# EAGLE design L6470Breakout (EAGLE 6.1)
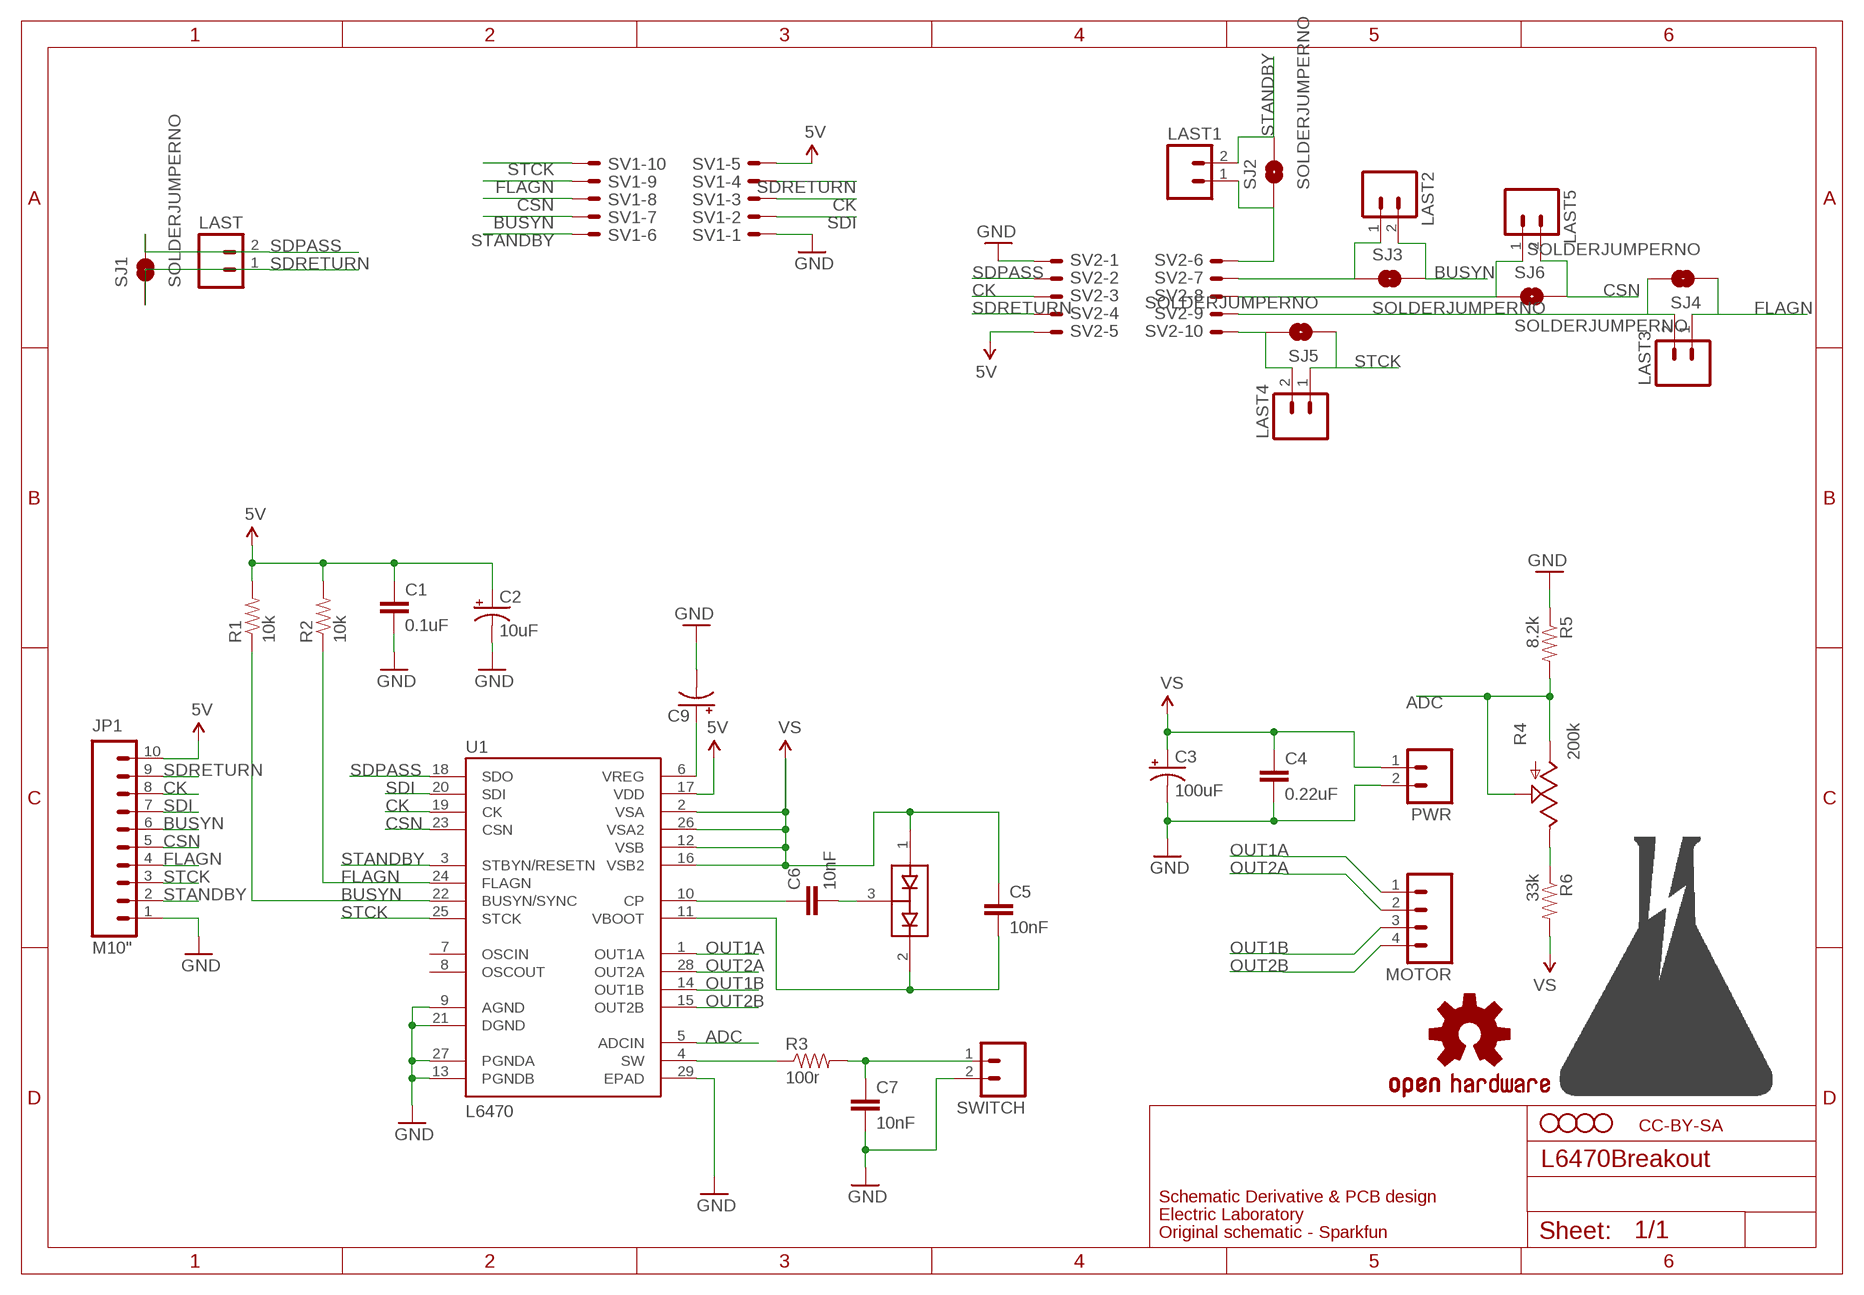
[diagram p0: schematic, sheet 1]

## Parts
C1  0.1uF  CAP0603-CAP  [0603-CAP]
C2  10uF  CAP_POL1206  [EIA3216]
C3  100uF  CAP_POLH13  [PANASONIC_H13]
C4  0.22uF  CAP0603-CAP  [0603-CAP]
C5  10nF  CAP0603-CAP  [0603-CAP]
C6  10nF  CAP0603-CAP  [0603-CAP]
C7  10nF  CAP0603-CAP  [0603-CAP]
C9  CAP_POL1206  [EIA3216]
D1  BAV99  [SOT23]
JP1  M10"  [1X10]
JP3  STAND-OFF  [STAND-OFF]
JP4  STAND-OFF  [STAND-OFF]
JP6  STAND-OFF  [STAND-OFF]
JP7  STAND-OFF  [STAND-OFF]
LAST  M02PTH  [1X02]
LAST1  M02PTH  [1X02]
LAST2  M02PTH  [1X02]
LAST3  M02PTH  [1X02]
LAST4  M02PTH  [1X02]
LAST5  M02PTH  [1X02]
MOTOR  M04SCREW  [SCREWTERMINAL-3.5MM-4]
PWR  M023.5MM  [SCREWTERMINAL-3.5MM-2]
R1  10k  RESISTOR0603-RES  [0603-RES]
R2  10k  RESISTOR0603-RES  [0603-RES]
R3  100r  RESISTOR0603-RES  [0603-RES]
R4  200k  POT100K_3362U  [3362U]
R5  8.2k  RESISTOR0603-RES  [0603-RES]
R6  33k  RESISTOR0603-RES  [0603-RES]
SJ1  SOLDERJUMPERNO  [SJ_2S-NO]
SJ2  SOLDERJUMPERNO  [SJ_2S-NO]
SJ3  SOLDERJUMPERNO  [SJ_2S-NO]
SJ4  SOLDERJUMPERNO  [SJ_2S-NO]
SJ5  SOLDERJUMPERNO  [SJ_2S-NO]
SJ6  SOLDERJUMPERNO  [SJ_2S-NO]
SV1  ML10E  [ML10]
SV2  ML10E  [ML10]
SWITCH  M023.5MM  [SCREWTERMINAL-3.5MM-2]
U1  L6470  L6470  [HTSSOP28]
U$4  OSHW-LOGOS  [OSHW-LOGO-S]
U$5  EL-LOGO  [EL-LOGO]

## Nets
5V: C1.1 C2.A(+) JP1.10 R1.2 R2.2 SV1.5 SV2.5 U1.17(VDD)
ADC: R4.P$2(S) R4.P$3(A) R5.2 U1.5(ADCIN)
BUSYN: JP1.6 LAST2.2 R1.1 SJ3.2 SV1.7 U1.22(BUSYN/SYNC)
CK: JP1.8 SV1.3 SV2.3 U1.19(CK)
CSN: JP1.5 LAST5.2 SJ6.2 SV1.8 U1.23(CSN)
FLAGN: JP1.4 LAST3.1 R2.1 SJ4.1 SV1.9 U1.24(FLAGN)
GND: C1.2 C2.C(-) C3.- C4.2 C7.2 C9.C(-) JP1.1 PWR.2 R5.1 SV1.1 SV2.1 SWITCH.2 U1.9(AGND) U1.13(PGNDB) U1.21(DGND) U1.27(PGNDA) U1.29(EPAD)
N$1: C9.A(+) U1.6(VREG)
N$2: LAST2.1 SJ3.1 SV2.7
N$3: LAST5.1 SJ6.1 SV2.8
N$5: R3.1 U1.4(SW)
N$6: C7.1 R3.2 SWITCH.1
N$7: C6.1 U1.10(CP)
N$8: C6.2 D1.3(COM)
N$9: C5.2 D1.2(C2) U1.11(VBOOT)
N$11: R4.P$1(E) R6.1
N$12: LAST3.2 SJ4.2 SV2.9
N$13: LAST1.1 SJ2.1 SV2.6
N$14: LAST4.2 SJ5.2 SV2.10
OUT1A: MOTOR.1 U1.1(OUT1A)
OUT1B: MOTOR.3 U1.14(OUT1B)
OUT2A: MOTOR.2 U1.28(OUT2A)
OUT2B: MOTOR.4 U1.15(OUT2B)
SDI: JP1.7 SV1.2 U1.20(SDI)
SDPASS: LAST.2 SJ1.2 SV2.2 U1.18(SDO)
SDRETURN: JP1.9 LAST.1 SJ1.1 SV1.4 SV2.4
STANDBY: JP1.2 LAST1.2 SJ2.2 SV1.6 U1.3(STBYN/RESETN)
STCK: JP1.3 LAST4.1 SJ5.1 SV1.10 U1.25(STCK)
VCC: C3.+ C4.1 C5.1 D1.1(A1) PWR.1 R6.2 U1.2(VSA) U1.12(VSB) U1.16(VSB2) U1.26(VSA2) ; supply symbol labelled VS
Unconnected: U1.7(OSCIN) U1.8(OSCOUT)

## Notes on the sheet
- CC-BY-SA
- Schematic Derivative & PCB design
- Electric Laboratory
- Original schematic - Sparkfun

## Library data of the parts
C1 C5-C7 = SparkFun-Passives:CAP: Capacitor Standard 0603 ceramic capacitor, and 0.1" leaded capacitor.
C2 = SparkFun:CAP_POL: Capacitor Polarized These are standard SMD and PTH capacitors. Normally 10uF, 47uF, and 100uF in electrolytic and tantalum varieties. Always verify the external diameter of the through hole cap, it varies with capacity, voltage, and manufacturer. The EIA devices should be standard.
C3 = miscellany:CAP_POL: Capacitor Polarized These are standard SMD and PTH capacitors. Normally 10uF, 47uF, and 100uF in electrolytic and tantalum varieties. Always verify the external diameter of the through hole cap, it varies with capacity, voltage, and manufacturer. The EIA devices should be standard.
C4 = SparkFun:CAP: Capacitor Standard 0603 ceramic capacitor, and 0.1" leaded capacitor.
C9 = SparkFun-Passives:CAP_POL: Capacitor Polarized These are standard SMD and PTH capacitors. Normally 10uF, 47uF, and 100uF in electrolytic and tantalum varieties. Always verify the external diameter of the through hole cap, it varies with capacity, voltage, and manufacturer. The EIA devices should be standard.
D1 = miscellany:BAV99: BAV99 Two small signal silicon diodes connected anode to cathode. Connections to all three nodes available.
JP1 = SparkFun:M10: Header 10 Standard 10-pin 0.1" header. Use with straight break away headers (SKU : PRT-00116), right angle break away headers (PRT-00553), swiss pins (PRT-00743), machine pins (PRT-00117), and female headers (PRT-00115).
JP3 JP4 JP6 JP7 = SparkFun-Electromechanical:STAND-OFF: #4 Stand Off This is the mechanical footprint for a #4 phillips button head screw. Use the keepout ring to avoid running the screw head into surrounding components. SKU : PRT-00447
LAST LAST1-LAST5 = SparkFun-Connectors:M02: Header 2 Standard 2-pin 0.1" header. Use with straight break away headers (SKU : PRT-00116), right angle break away headers (PRT-00553), swiss pins (PRT-00743), machine pins (PRT-00117), and female headers (PRT-00115). Molex polarized connector foot print use with SKU : PRT-08233 with associated crimp pins and housings.
MOTOR = SparkFun-Connectors:M04: Header 4 Standard 4-pin 0.1" header. Use with straight break away headers (SKU : PRT-00116), right angle break away headers (PRT-00553), swiss pins (PRT-00743), machine pins (PRT-00117), and female headers (PRT-00115). Molex polarized connector foot print use with SKU : PRT-08231 with associated crimp pins and housings. 1MM SMD Version SKU: PRT-10208
PWR SWITCH = SparkFun:M02: Header 2 Standard 2-pin 0.1" header. Use with straight break away headers (SKU : PRT-00116), right angle break away headers (PRT-00553), swiss pins (PRT-00743), machine pins (PRT-00117), and female headers (PRT-00115). Molex polarized connector foot print use with SKU : PRT-08233 with associated crimp pins and housings.
R1-R3 R5 R6 = SparkFun-Passives:RESISTOR: Resistor Basic schematic elements and footprints for 0603, 1206, and PTH resistors.
R4 = SparkFun:POT
SJ1-SJ6 = SparkFun-Passives:SOLDERJUMPER: Solder Jumper Standard SMD solder jumper. Used to automate production. Two varients : Normally Open and Normally Closed are the same, but have different paste layers. NC will have a large amount of paste and should jumper during reflow.
SV1 SV2 = con-harting-ml:ML10?E: HARTING; OC_FARNELL: unknown; OC_NEWARK: unknown
U1 = miscellany:L6470: L6470 3A RMS/7A peak bipolar stepper motor driver with SPI control and step input in HTSSOP-28 package.
U$4 = SparkFun:OSHW-LOGO: Open Source Hardware Logo This logo indicates the piece of hardware it is found on incorporates a OSHW license and/or adheres to the definition of open source hardware found here: http://freedomdefined.org/OSHW
U$5 = ElectricLaboratoryLib:EL-LOGO

## Board
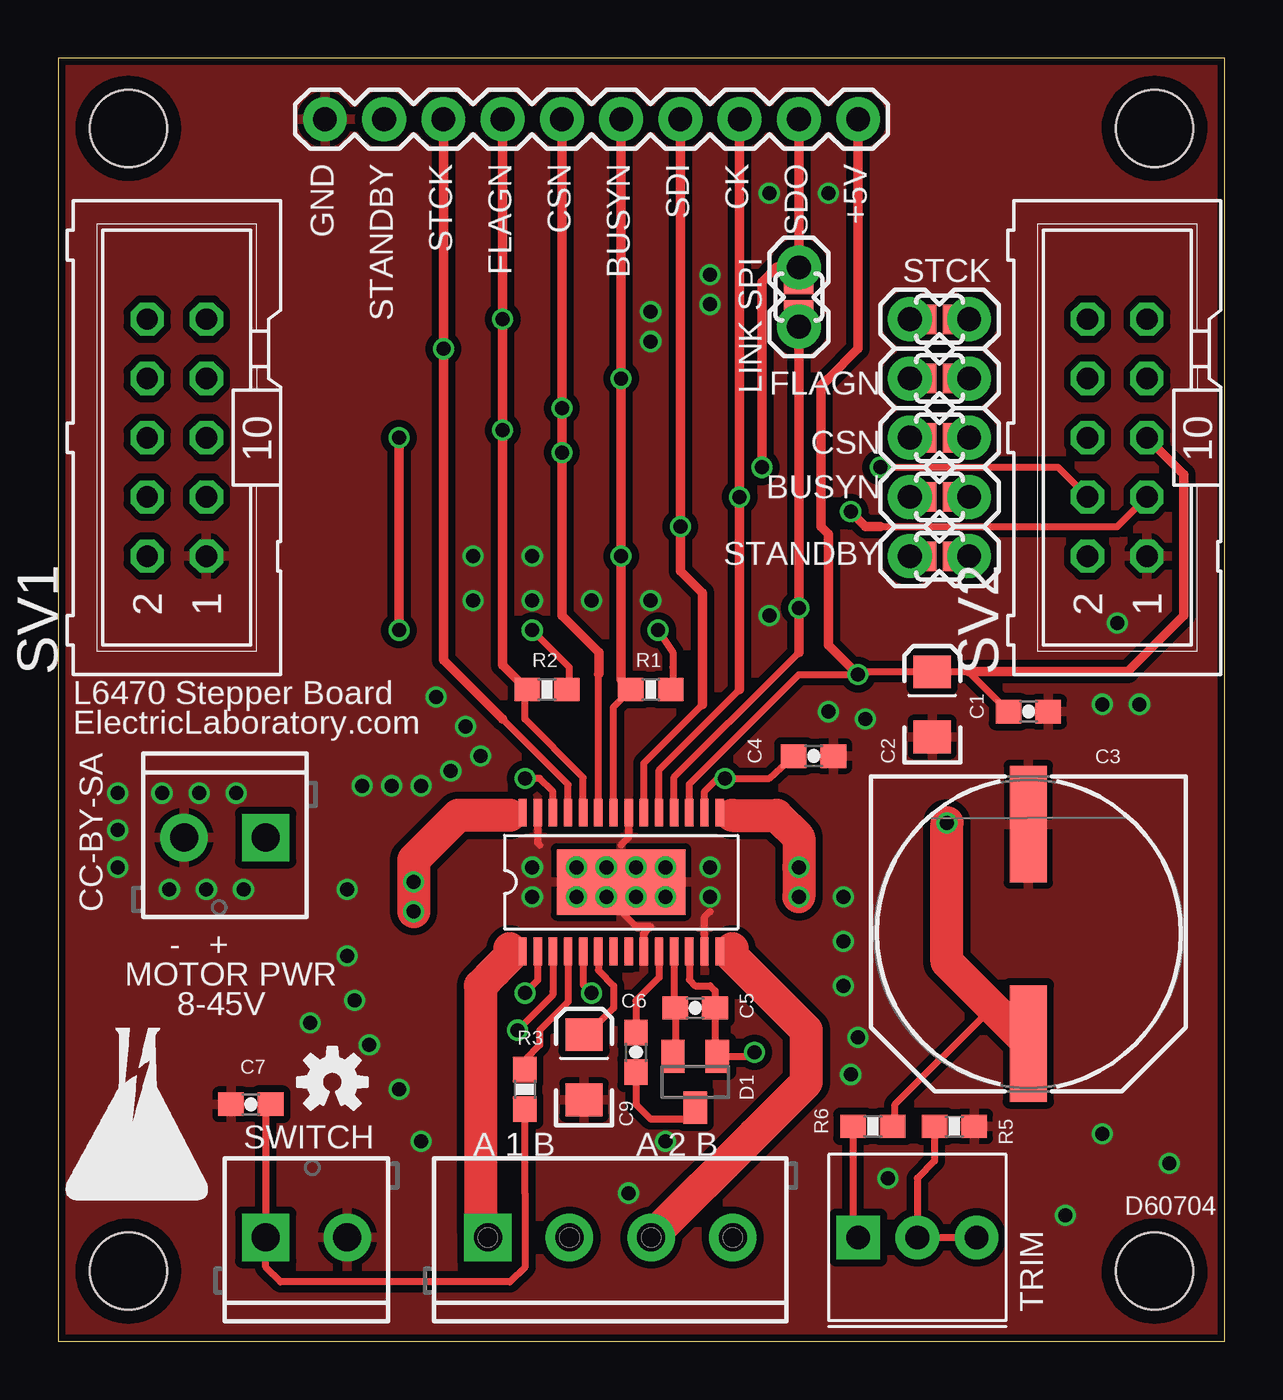
[diagram p1: board, top side]
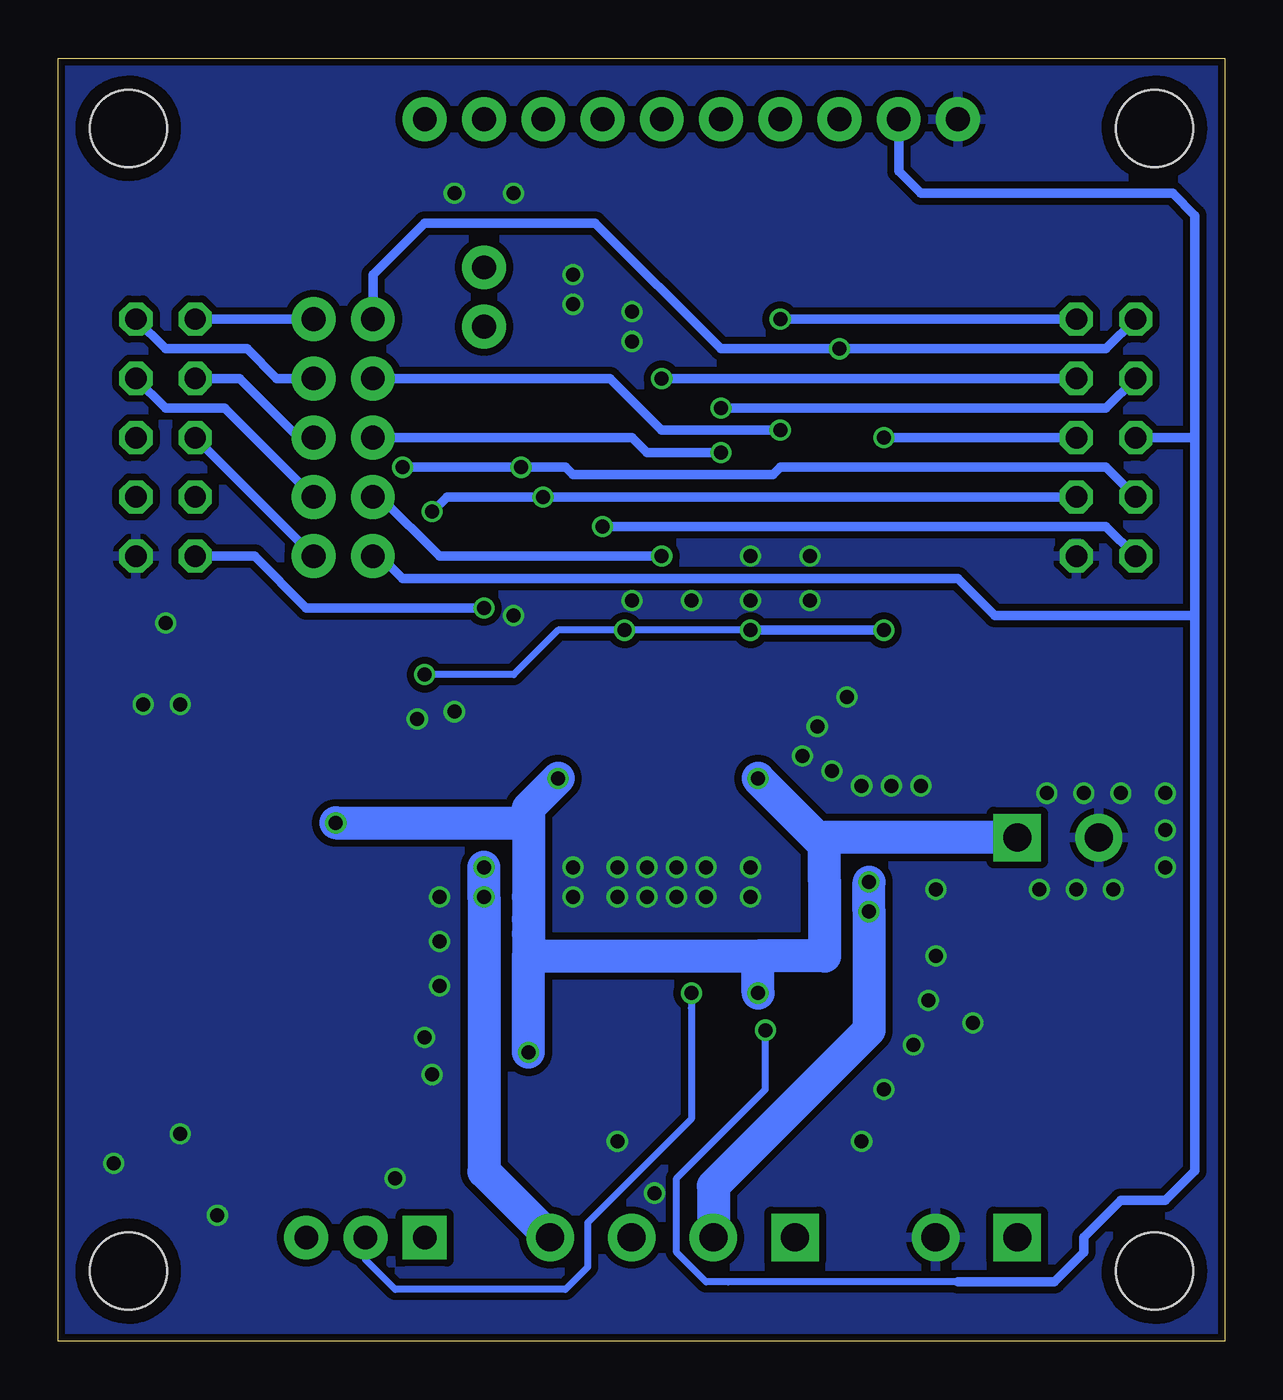
[diagram p2: board, bottom side, seen from below]

Size 50 x 55 mm. Coordinates in mm from the lower left corner, seen from the top.
Outline: 0,0 50,0 50,55 0,55 0,0
Copper layers (1*16): Top 0.035mm / dielectric 1.5mm / Bottom 0.035mm
Design rules: minimum track width 6mil, minimum drill 12mil, track to track 6mil, track to pad 6mil, pad to pad 6mil, via to via 6mil, smd to smd 0mil, copper to edge 10mil, drill to drill 10mil, minimum pad ring 10mil, minimum via ring 6mil, stop-mask expansion 2mil, vias tented up to drill 100mil, thermal gap 10mil

### Footprints (pad centres in the part's own frame; a part is rotated, then mirrored left to right if it is on the bottom)
0603-CAP = smd 1.1 x 1: 1 -0.85,0; 2 0.85,0
EIA3216 = smd 1.4 x 1.6: A 1.4,0; C -1.4,0
PANASONIC_H13 = smd 5 x 1.6: + 4.7,0; - -4.7,0
SOT23 = smd 1 x 1.4: 1 -0.95,-1.1; 2 0.95,-1.1; 3 0,1.1
1X10 = drill 1.016 pad 1.88: 1 0,0; 2 2.54,0; 3 5.08,0; 4 7.62,0; 5 10.16,0; 6 12.7,0; 7 15.24,0; 8 17.78,0; 9 20.32,0; 10 22.86,0
STAND-OFF = hole 3.302: 0,0
1X02 = drill 1.016 pad 1.88: 1 0,0; 2 2.54,0
SCREWTERMINAL-3.5MM-4 = drill 1.2 pad 2.032 square: 1 0,0 | drill 1.2 pad 2.032: 2 3.5,0; 3 7,0; 4 10.5,0
SCREWTERMINAL-3.5MM-2 = drill 1.2 pad 2.032 square: 1 0,0 | drill 1.2 pad 2.032: 2 3.5,0
0603-RES = smd 1.1 x 1: 1 -0.85,0; 2 0.85,0
3362U = drill 1.016 pad 1.88 square: P$1 0,2.54 | drill 1.016 pad 1.88: P$2 2.54,2.54; P$3 5.08,2.54
SJ_2S-NO = smd 0.635 x 1.27: 1 -0.45,0; 2 0.45,0
ML10 = drill 0.914 octagon: 1 -5.08,-1.27; 2 -5.08,1.27; 3 -2.54,-1.27; 4 -2.54,1.27; 5 0,-1.27; 6 0,1.27; 7 2.54,-1.27; 8 2.54,1.27; 9 5.08,-1.27; 10 5.08,1.27
HTSSOP28 = smd 0.36 x 1.19: 1 -4.225,-2.97; 2 -3.575,-2.97; 3 -2.925,-2.97; 4 -2.275,-2.97; 5 -1.625,-2.97; 6 -0.975,-2.97; 7 -0.325,-2.97; 8 0.325,-2.97; 9 0.975,-2.97; 10 1.625,-2.97; 11 2.275,-2.97; 12 2.925,-2.97; 13 3.575,-2.97; 14 4.225,-2.97; 15 4.225,2.97; 16 3.575,2.97; 17 2.925,2.97; 18 2.275,2.97; 19 1.625,2.97; 20 0.975,2.97; 21 0.325,2.97; 22 -0.325,2.97; 23 -0.975,2.97; 24 -1.625,2.97; 25 -2.275,2.97; 26 -2.925,2.97; 27 -3.575,2.97; 28 -4.225,2.97 | smd 5.5 x 2.8: 29 0,0

### Placement (x,y rotation side)
C1  41.59,26.99 0 top
C2  37.47,27.3 90 top
C3  41.59,17.46 270 top
C4  32.38,25.08 0 top
C5  27.3,14.29 180 top
C6  24.77,12.38 270 top
C7  8.26,10.16 180 top
C9  22.54,11.75 90 top
D1  27.3,11.11 180 top
JP1  11.43,52.39 0 top
JP3  3,3 0 top
JP4  47,3 0 top
JP6  3,52 0 top
JP7  47,52 0 top
LAST  31.75,46.04 270 top
LAST1  39.05,33.66 180 top
LAST2  39.05,36.2 180 top
LAST3  36.51,41.27 0 top
LAST4  36.51,43.81 0 top
LAST5  39.05,38.73 180 top
MOTOR  18.41,4.45 0 top
PWR  8.89,21.59 180 top
R1  25.4,27.94 0 top
R2  20.95,27.94 0 top
R3  20,10.79 270 top
R4  34.29,1.91 0 top
R5  38.42,9.21 180 top
R6  34.92,9.21 0 top
SJ1  31.75,44.77 270 top
SJ2  37.78,33.66 180 top
SJ3  37.78,36.2 180 top
SJ4  37.78,41.27 0 top
SJ5  37.78,43.81 0 top
SJ6  37.78,38.73 180 top
SV1  5.08,38.73 90 top
SV2  45.4,38.73 90 top
SWITCH  8.89,4.45 0 top
U1  24.13,19.68 0 top
U$4  11.75,11.11 0 top
U$5  0.32,6.03 0 top

### Tracks (layer width: path | path; a pad name or v marks a point on that pad's centre or on a via)
5V  (via drill 0.6)
  Top 0.305: R2.2 21.91,27.84 21.91,28.89 v20.32,30.48 | U1.17 27.05,23.88 28.89,25.72 31.75,28.57 v34.29,28.57 34.42,28.7 C2.A 39.02,28.7 39.1,28.63 | v25.72,30.48 26.35,29.53 26.35,28.89 26.35,27.94 R1.2 | 39.1,28.63 C1.1 | 39.16,28.57 39.1,28.63
  Top 0.406: v14.61,38.73 v14.61,30.48 | JP1.10 34.29,42.86 34.29,42.55 33.02,41.27 32.7,40.96 32.7,34.92 33.02,34.61 33.02,29.84 v34.29,28.57 | 39.02,28.7 45.85,28.7 48.26,31.11 48.26,37.15 SV2.5
  Bottom 0.305: v20.32,30.48 v25.72,30.48 28.57,30.48 30.48,28.57 v34.29,28.57
  Bottom 0.406: v14.61,30.48 v20.32,30.48 | SV1.5 v14.61,38.73
ADC  (via drill 0.6)
  Top 0.305: R5.2 37.57,7.72 36.83,6.99 R4.P$2 R4.P$3 | U1.5 22.5,15.28 v22.86,14.92
  Bottom 0.305: v22.86,14.92 22.86,14.29 22.86,9.53 23.81,8.57 27.3,5.08 27.3,3.17 28.26,2.22 35.56,2.22 36.83,3.49 R4.P$2
BUSYN  (via drill 0.6)
  Top 0.305: U1.22 23.8,27.2 R1.1 24.55,28.04 24.61,28.1
  Top 0.406: 24.61,28.1 24.77,27.94 | JP1.6 v24.13,41.27 24.13,36.51 v24.13,33.66 24.13,28.36 R1.1
  Top 0.61: SJ3.2 LAST2.2
  Bottom 0.406: SV1.7 v24.13,41.27 | LAST2.2 36.2,36.2 33.66,33.66 v24.13,33.66
CK  (via drill 0.6)
  Top 0.305: U1.19 25.75,24.48 28.26,26.99 29.21,27.94 | 35.24,34.92 45.4,34.92 SV2.3
  Top 0.406: JP1.8 29.21,37.47 v29.21,36.2 29.21,27.94 | v33.97,35.56 34.61,34.92 35.24,34.92
  Bottom 0.406: SV1.3 v29.21,36.2 33.34,36.2 v33.97,35.56
CSN  (via drill 0.6)
  Top 0.305: U1.23 23.16,28.6
  Top 0.406: JP1.5 v21.59,40.01 21.59,38.73 v21.59,38.1 21.59,31.11 23.18,29.53 23.18,28.62 23.16,28.6
  Top 0.61: SJ6.2 LAST5.2
  Bottom 0.406: SV1.8 5.08,40.01 v21.59,40.01 | LAST5.2 25.4,38.73 24.77,38.1 v21.59,38.1
FLAGN  (via drill 0.6)
  Top 0.305: U1.24 22.5,24.17 20,26.67 20,27.94 R2.1
  Top 0.406: JP1.4 v19.05,43.81 19.05,41.27 v19.05,39.05 19.05,29 R2.1
  Top 0.61: LAST3.1 SJ4.1
  Bottom 0.406: SV1.9 v19.05,43.81 | LAST3.1 26.35,41.27 24.13,39.05 v19.05,39.05
GND  (via drill 0.6)
  Top 0.305: U1.13 27.7,18.18 27.94,18.41 | U1.9 25.11,17.48 25.4,17.78 24.77,17.78 24.13,18.41 | U1.21 24.45,21.6 24.13,21.27 | U1.27 20.55,21.36 20.64,21.27
  other vias: 22.23,20.32 22.23,19.05 23.5,19.05 23.5,20.32 24.77,20.32 24.77,19.05 26.04,20.32 26.04,19.05 20.32,20.32 20.32,19.05 27.94,20.32 27.94,19.05 33.66,17.14 33.66,19.05 2.54,21.91 2.54,23.5 33.66,15.24 18.1,25.08 16.83,24.45 15.56,23.81 16.19,27.62 17.46,26.35 2.54,20.32 7.62,23.5 6.03,23.5 4.45,23.5 4.76,19.37 7.94,19.37 6.35,19.37 12.38,16.51 10.79,13.65 33.02,26.99 44.77,8.89 43.18,5.4 47.62,7.62 14.61,10.79 35.56,6.99 14.29,23.81 12.7,14.61 12.38,19.37 13.02,23.81 15.56,8.57 13.34,12.7 34.29,13.02 33.97,11.43 34.61,26.67 46.35,27.3 45.4,30.8 44.77,27.3 24.45,6.35 26.04,8.57 17.78,31.75 17.78,33.66 20.32,33.66 20.32,31.75 22.86,31.75 25.4,31.75 25.4,42.86 25.4,44.13 27.94,45.72 27.94,44.45 30.48,31.11 30.48,49.21 33.02,49.21
  pour Bottom (isolate 0.305): 0,0 50,0 50,54.88 0,54.85
  pour Top (isolate 0.305): 0,0 50,0 50,54.88 0,54.85
N$1
  Top 0.305: U1.6 23.16,15.9 23.81,15.24 23.81,14.29 22.54,13.02 C9.A
N$2
  Top 0.61: SJ3.1 LAST2.1
  Bottom 0.406: LAST2.1 42.86,40.01 45.4,40.01 SV2.7
N$3
  Top 0.61: SJ6.1 LAST5.1
  Bottom 0.406: LAST5.1 39.69,38.73 42.23,41.27 SV2.8
N$5
  Top 0.305: 20,11.75 R3.1 20,12.06 20.64,12.7 20.64,13.34 21.86,14.55 U1.4
N$6
  Top 0.305: C7.1 8.89,9.95 SWITCH.1 8.89,3.17 9.53,2.54 19.37,2.54 20,3.17 20,6.35 R3.2
N$7
  Top 0.305: U1.10 25.75,15.6 24.77,14.61 C6.1
N$8
  Top 0.305: C6.2 24.77,10.16 25.4,9.53 27.14,9.53 D1.3
N$9
  Top 0.305: U1.11 26.41,14.02 C5.2 26.45,11.99 D1.2
N$11
  Top 0.305: R6.1 34.08,4.66 R4.P$1
N$12
  Top 0.61: SJ4.2 LAST3.2
  Bottom 0.406: LAST3.2 40.64,41.27 41.91,42.55 45.4,42.55 SV2.9
N$13
  Top 0.61: SJ2.1 LAST1.1
  Bottom 0.406: LAST1.1 SV2.6
N$14
  Top 0.61: SJ5.2 LAST4.2
  Bottom 0.406: LAST4.2 SV2.10
OUT1A
  Top 0.305: U1.1 19.48,16.71 19.37,16.83
  Top 1.422: 19.37,16.83 19.37,16.51 18.73,15.88 18.1,15.24 18.1,4.76 MOTOR.1
OUT1B
  Top 0.305: U1.14 28.78,16.71 28.89,16.83
  Top 1.422: 28.89,16.83 28.89,16.51 29.84,15.56 32.07,13.34 32.07,11.1 29.84,8.88 MOTOR.3
OUT2A  (via drill 0.6)
  Top 0.305: U1.28 19.79,22.54 19.37,22.54
  Top 1.422: 19.37,22.54 18.73,22.54 17.14,22.54 15.24,20.64 v15.24,19.68 v15.24,18.41
  Bottom 1.422: MOTOR.2 21.91,6.66 17.46,11.11 15.24,13.34 v15.24,18.41 v15.24,19.68
OUT2B  (via drill 0.6)
  Top 0.305: U1.15 28.78,22.66 28.89,22.54
  Top 1.422: 28.89,22.54 30.8,22.54 31.75,21.59 v31.75,20.32 v31.75,19.05
  Bottom 1.422: MOTOR.4 31.75,7.28 v31.75,19.05 v31.75,20.32
SDI  (via drill 0.6)
  Top 0.305: U1.20 25.11,24.79 27.62,27.3
  Top 0.406: JP1.7 26.67,35.24 v26.67,34.92 26.67,33.02 27.62,32.07 27.62,27.3
  Bottom 0.406: SV1.2 5.08,34.92 v26.67,34.92
SDPASS  (via drill 0.6)
  Top 0.305: U1.18 26.41,24.18 31.11,28.89 31.75,29.53
  Top 0.406: SJ1.2 LAST.2 v31.75,31.43 31.75,29.53
  Bottom 0.406: SV2.2 41.59,33.66 39.37,31.43 v31.75,31.43
SDRETURN  (via drill 0.6)
  Top 0.305: v35.24,37.47 42.86,37.47 SV2.4
  Top 0.406: SJ1.1 LAST.1 | LAST.1 JP1.9 | v30.16,37.47 30.16,45.4 30.8,46.04 LAST.1
  Bottom 0.406: SV1.4 5.08,37.47 19.05,37.47 19.37,37.15 27.94,37.15 28.26,37.47 v30.16,37.47 v35.24,37.47
STANDBY  (via drill 0.6)
  Top 0.305: U1.3 21.2,14.99 21.2,14.86 v19.68,13.34
  Top 0.61: SJ2.2 LAST1.2
  Bottom 0.305: v19.68,13.34 19.68,10.79 23.5,6.99 23.5,3.81 23.18,3.49 22.23,2.54 21.27,2.54 11.43,2.54
  Bottom 0.406: 1.27,38.73 1.27,41.59 1.27,41.91 1.27,48.26 2.22,49.21 13.02,49.21 13.97,50.16 JP1.2 | 1.27,38.73 1.27,32.7 1.27,31.11 | 1.27,31.11 1.27,8.57 1.27,7.3 2.54,6.03 4.45,6.03 6.03,4.45 6.03,3.81 7.3,2.54 11.43,2.54 | SV1.6 1.27,38.73 | LAST1.2 36.2,33.66 35.24,32.7 11.43,32.7 9.84,31.11 1.27,31.11
STCK  (via drill 0.6)
  Top 0.305: U1.25 21.86,23.86 19.05,26.67
  Top 0.406: JP1.3 16.51,43.81 v16.51,42.55 16.51,29.21 19.05,26.67
  Top 0.61: LAST4.1 SJ5.1
  Bottom 0.406: SV1.10 5.08,42.55 v16.51,42.55 21.59,42.55 26.99,47.94 34.29,47.94 36.51,45.72 LAST4.1
VCC  (via drill 0.6)
  Top 0.305: U1.12 27.05,15.49 27.3,15.24 27.94,15.24 28.16,15.03 C5.1 28.16,11.99 D1.1 29.68,12.21 v29.84,12.38 | U1.26 21.2,23.56 20.64,24.13 v20,24.13 | U1.16 27.7,23.26 27.7,23.58 27.94,23.81 28.26,24.13 v28.57,24.13 30.48,24.13 C4.1 | U1.2 20.55,15.47 v20,14.92 | R6.2 35.88,9.31 35.88,10.16 40.04,14.32
  Top 1.422: C3.+ 40.04,14.32 38.1,16.25 v38.1,22.23
  Bottom 1.422: v20,14.92 20,16.51 | v29.84,12.38 29.84,16.51 | 17.3,21.43 17.14,21.27 17.14,19.68 17.14,16.51 20,16.51 | 17.3,21.43 v20,24.13 | v28.57,24.13 29.84,22.86 29.84,22.23 | 29.84,22.23 29.84,19.05 29.84,18.1 29.84,17.46 29.84,16.51 | 29.84,16.51 20,16.51 | v38.1,22.23 29.84,22.23 | PWR.1 17.14,21.59 17.3,21.43

### Text on the board
tPlace: GND | STANDBY | STCK | FLAGN | CSN | BUSYN | SDI | CK | SDO | +5V | STCK | FLAGN | LINK SPI | CSN | BUSYN | STANDBY | L6470 Stepper Board | ElectricLaboratory.com | CC-BY-SA | - + | MOTOR PWR | 8-45V | SWITCH | A 1 B | A 2 B | D60704 | TRIM